# EAGLE design Wise-1510-v1.1.0 (EAGLE 7.7.0)

## Sheet 1 of 2
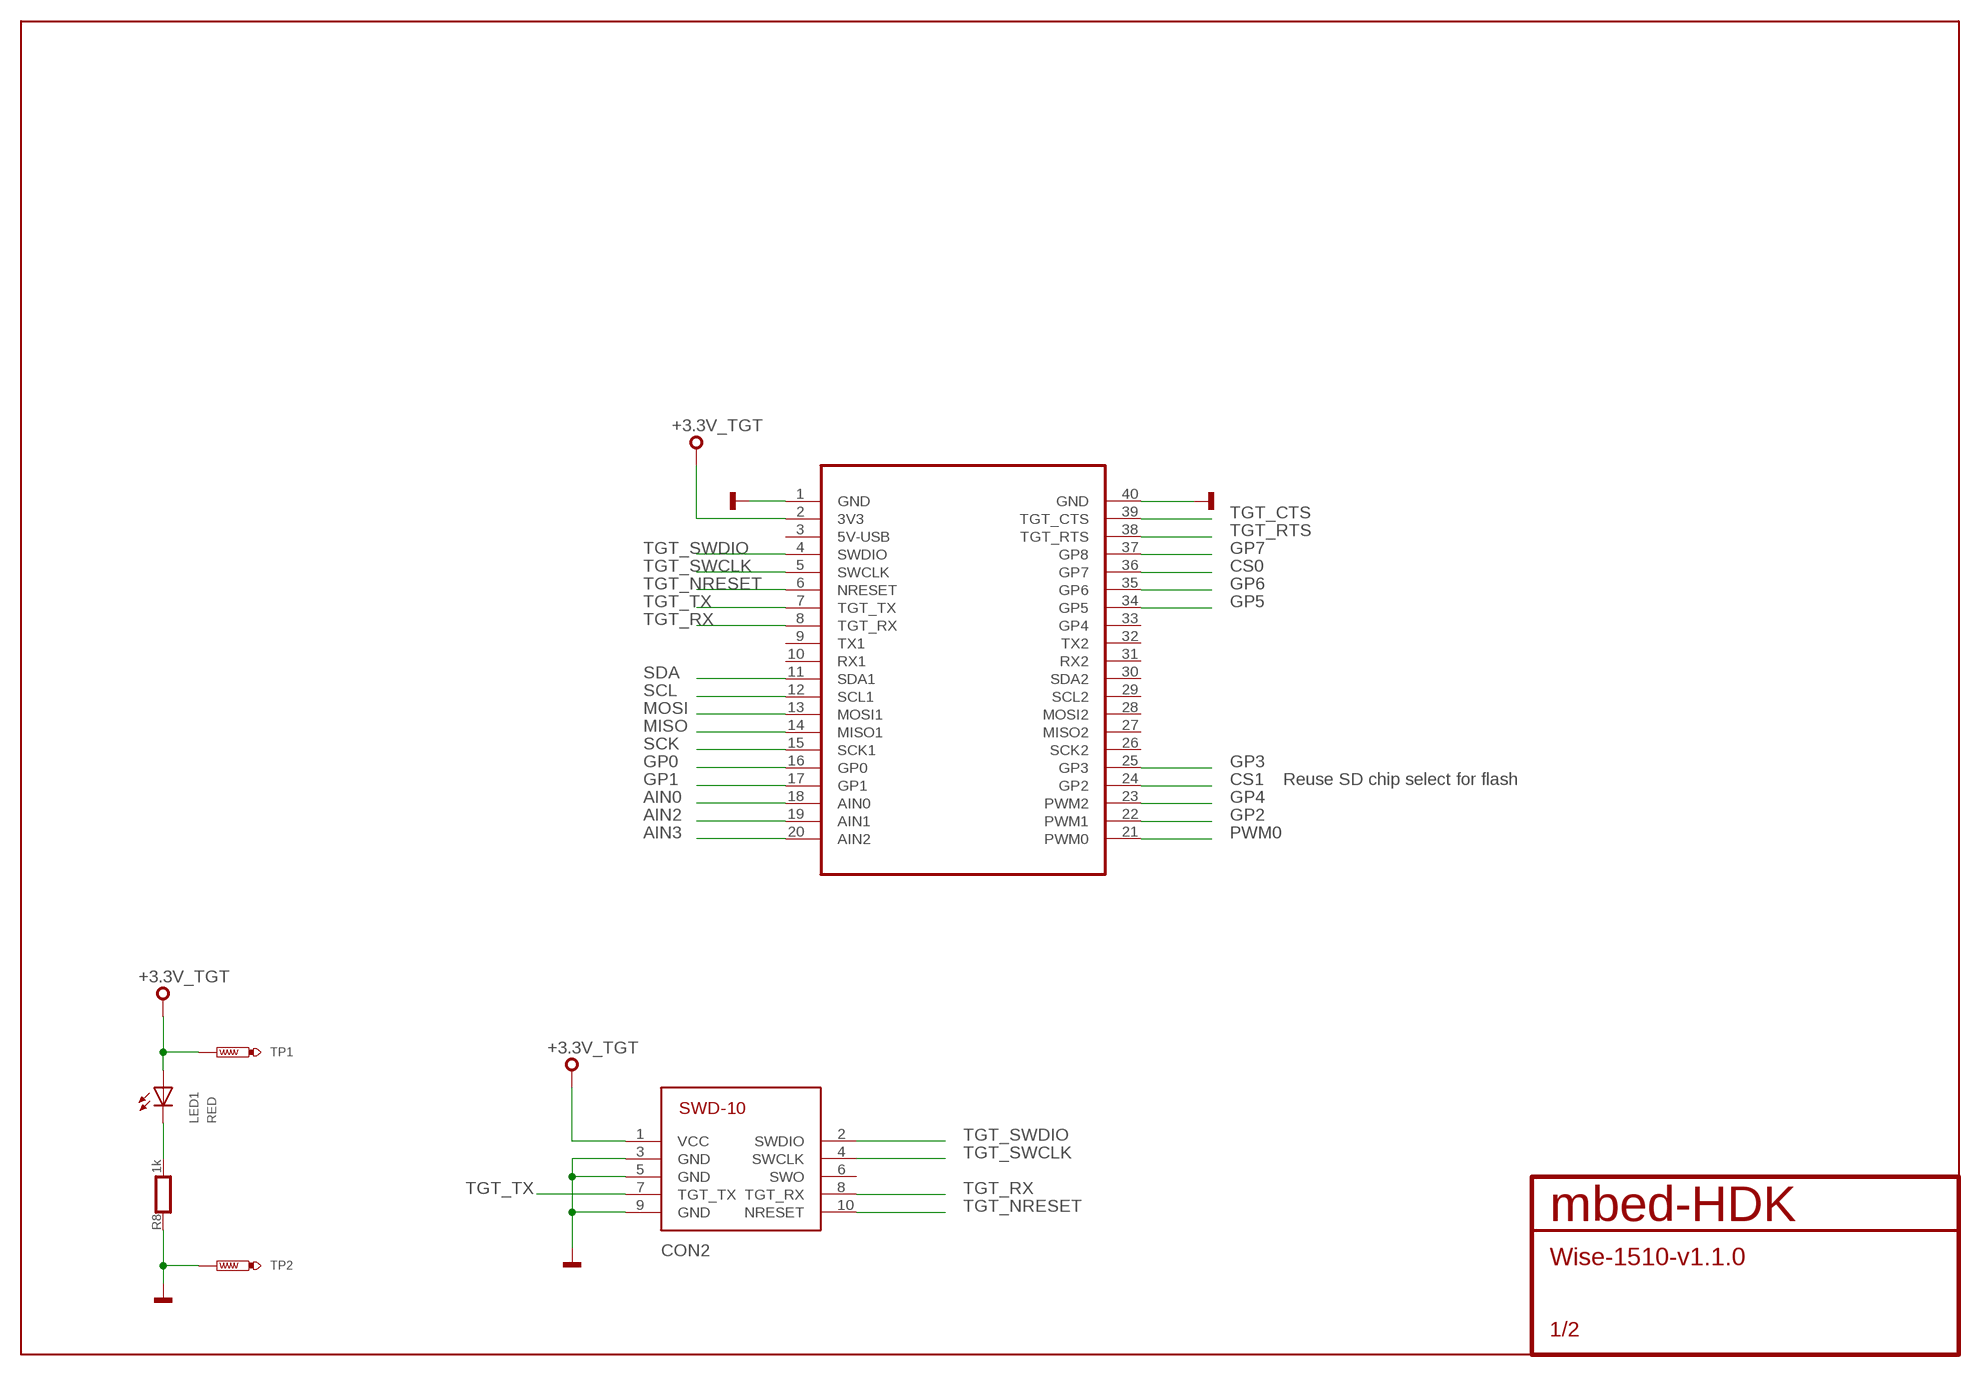
[diagram p0: schematic, sheet 1]

### Parts
CON2  SWD-10/TC2050_SMD  [FTSH-105-02]
LED1  RED  SMD_LED0603  [CHIPLED_0603]
R8  1k  RESISTOR0603  [0603]
TP1  TEST-POINT-50R-PTH  [TP50-PTH]
TP2  TEST-POINT-50R-PTH  [TP50-PTH]
U$1  MODULE_DAUGHTER  [MODULE_DAUGHTER]

### Nets
+3.3V_TGT: CON2.1(VCC) LED1.A TP1.TP U$1.2(3V3) ; also sheet 2
AIN0: U$1.18(AIN0) ; also sheet 2
AIN2: U$1.19(AIN1) ; also sheet 2
AIN3: U$1.20(AIN2) ; also sheet 2
CS0: U$1.36(GP7) ; also sheet 2
CS1: U$1.24(GP2) ; also sheet 2
GND: CON2.3(GND) CON2.5(GND) CON2.9(GND) R8.1 TP2.TP U$1.1(GND) U$1.40(GND) ; also sheet 2
GP0: U$1.16(GP0) ; also sheet 2
GP1: U$1.17(GP1) ; also sheet 2
GP2: U$1.22(PWM1) ; also sheet 2
GP3: U$1.25(GP3) ; also sheet 2
GP4: U$1.23(PWM2) ; also sheet 2
GP5: U$1.34(GP5) ; also sheet 2
GP6: U$1.35(GP6) ; also sheet 2
GP7: U$1.37(GP8) ; also sheet 2
MISO: U$1.14(MISO1) ; also sheet 2
MOSI: U$1.13(MOSI1) ; also sheet 2
PA_1: LED1.C R8.2
PWM0: U$1.21(PWM0) ; also sheet 2
SCK: U$1.15(SCK1) ; also sheet 2
SCL: U$1.12(SCL1) ; also sheet 2
SDA: U$1.11(SDA1) ; also sheet 2
TGT_CTS: U$1.39(TGT_CTS) ; also sheet 2
TGT_NRESET: CON2.10(NRESET) U$1.6(NRESET) ; also sheet 2
TGT_RTS: U$1.38(TGT_RTS) ; also sheet 2
TGT_RX: CON2.8(TGT_RX) U$1.8(TGT_RX) ; also sheet 2
TGT_SWCLK: CON2.4(SWCLK) U$1.5(SWCLK) ; also sheet 2
TGT_SWDIO: CON2.2(SWDIO) U$1.4(SWDIO) ; also sheet 2
TGT_TX: CON2.7(TGT_TX) U$1.7(TGT_TX) ; also sheet 2
Unconnected: CON2.6(SWO) U$1.3(5V-USB) U$1.9(TX1) U$1.10(RX1) U$1.26(SCK2) U$1.27(MISO2) U$1.28(MOSI2) U$1.29(SCL2) U$1.30(SDA2) U$1.31(RX2) U$1.32(TX2) U$1.33(GP4)

### Notes on the sheet
- Reuse SD chip select for flash

## Sheet 2 of 2
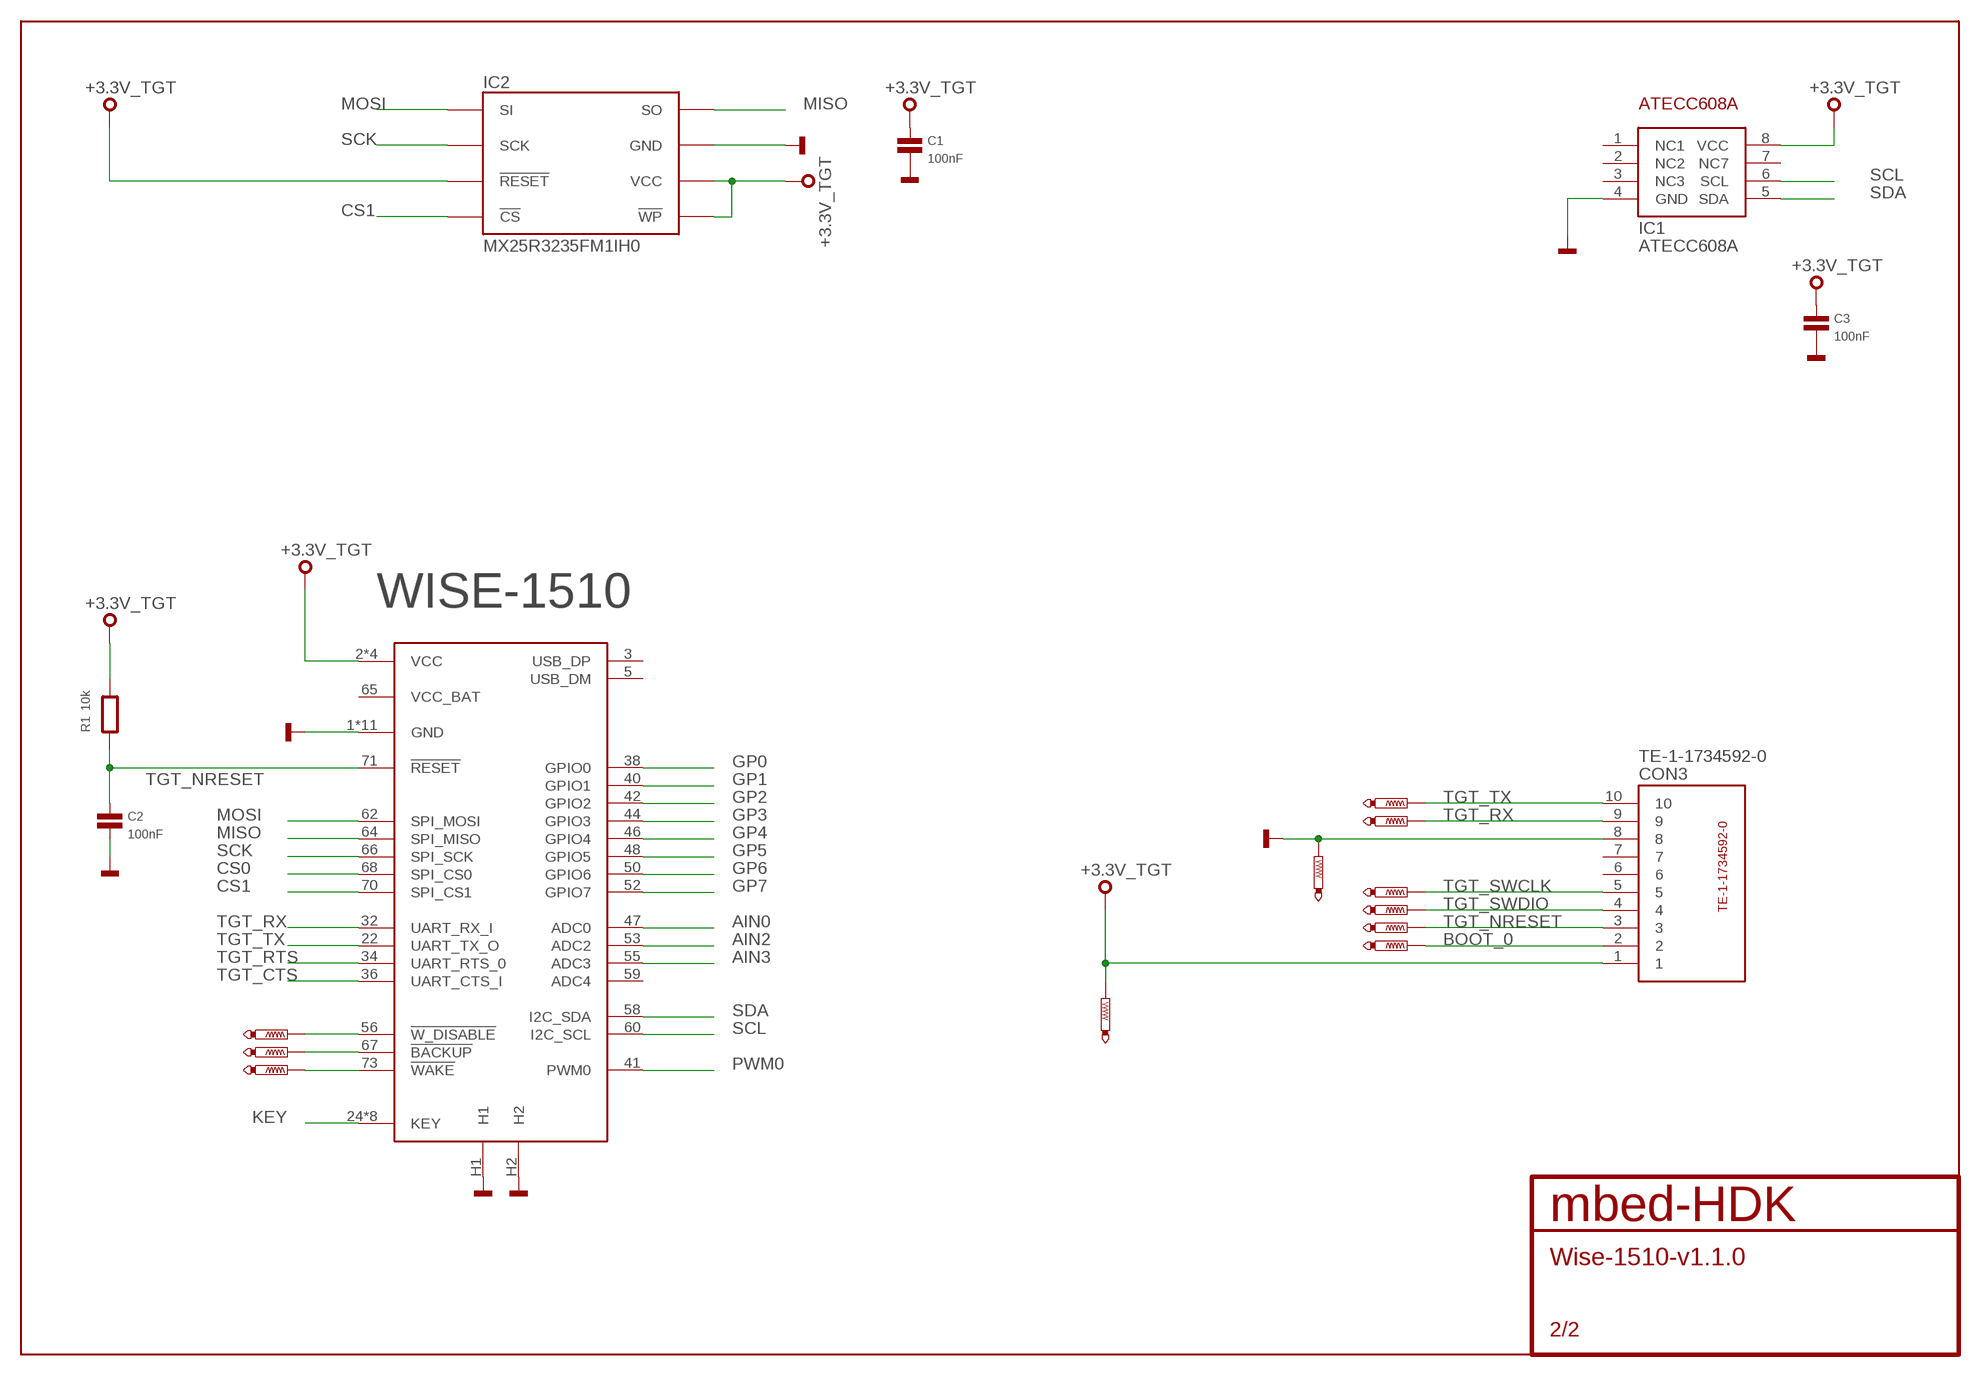
[diagram p1: schematic, sheet 2]

### Parts
C1  100nF  CAPACITOR0603  [0603]
C2  100nF  CAPACITOR0603  [0603]
C3  100nF  CAPACITOR0603  [0603]
CON1  WISE-1510_E  [MDT420E02001]
CON3  TE-1-1734592-0  [TE-1-1734592-0]
IC1  ATECC608A  [SO8]
IC2  MX25R3235FM1IH0  [SO8]
R1  10k  RESISTOR0603  [0603]
TP3  PTR1TP08R  [TP08R]
TP4  PTR1TP08R  [TP08R]
TP5  PTR1TP08R  [TP08R]
TP6  PTR1TP08R  [TP08R]
TP7  PTR1TP08R  [TP08R]
TP8  PTR1TP08R  [TP08R]
TP9  PTR1B1,27  [B1,27]
TP10  PTR1B1,27  [B1,27]
TP11  PTR1B1,27  [B1,27]
TP12  PTR1TP08R  [TP08R]
TP13  PTR1TP08R  [TP08R]

### Nets
+3.3V_TGT: C1.1 C3.1 CON1.2(VCC) CON1.4(VCC) CON1.72(VCC) CON1.74(VCC) CON3.1 IC1.8(VCC) IC2.3(!WP) IC2.7(!RESET) IC2.8(VCC) R1.2 TP12.TP ; also sheet 1
AIN0: CON1.47(ADC0) ; also sheet 1
AIN2: CON1.53(ADC2) ; also sheet 1
AIN3: CON1.55(ADC3) ; also sheet 1
BOOT_0: CON3.2 TP8.TP
CS0: CON1.68(SPI_CS0) ; also sheet 1
CS1: CON1.70(SPI_CS1) IC2.1(!CS) ; also sheet 1
GND: C1.2 C2.2 C3.2 CON1.1(GND) CON1.7(GND) CON1.18(GND) CON1.33(GND) CON1.39(GND) CON1.45(GND) CON1.51(GND) CON1.57(GND) CON1.63(GND) CON1.69(GND) CON1.75(GND) CON1.H1 CON1.H2 CON3.8 IC1.4(GND) IC2.4(GND) TP13.TP ; also sheet 1
GP0: CON1.38(GPIO0) ; also sheet 1
GP1: CON1.40(GPIO1) ; also sheet 1
GP2: CON1.42(GPIO2) ; also sheet 1
GP3: CON1.44(GPIO3) ; also sheet 1
GP4: CON1.46(GPIO4) ; also sheet 1
GP5: CON1.48(GPIO5) ; also sheet 1
GP6: CON1.50(GPIO6) ; also sheet 1
GP7: CON1.52(GPIO7) ; also sheet 1
KEY: CON1.24(KEY) CON1.25(KEY) CON1.26(KEY) CON1.27(KEY) CON1.28(KEY) CON1.29(KEY) CON1.30(KEY) CON1.31(KEY)
MISO: CON1.64(SPI_MISO) IC2.2(SO) ; also sheet 1
MOSI: CON1.62(SPI_MOSI) IC2.5(SI) ; also sheet 1
N$3: CON1.56(!W_DISABLE) TP9.TP
N$4: CON1.67(!BACKUP) TP10.TP
N$5: CON1.73(!WAKE) TP11.TP
PWM0: CON1.41(PWM0) ; also sheet 1
SCK: CON1.66(SPI_SCK) IC2.6(SCK) ; also sheet 1
SCL: CON1.60(I2C_SCL) IC1.6(SCL) ; also sheet 1
SDA: CON1.58(I2C_SDA) IC1.5(SDA) ; also sheet 1
TGT_CTS: CON1.36(UART_CTS_I) ; also sheet 1
TGT_NRESET: C2.1 CON1.71(!RESET) CON3.3 R1.1 TP5.TP ; also sheet 1
TGT_RTS: CON1.34(UART_RTS_0) ; also sheet 1
TGT_RX: CON1.32(UART_RX_I) CON3.9 TP6.TP ; also sheet 1
TGT_SWCLK: CON3.5 TP3.TP ; also sheet 1
TGT_SWDIO: CON3.4 TP4.TP ; also sheet 1
TGT_TX: CON1.22(UART_TX_O) CON3.10 TP7.TP ; also sheet 1
Unconnected: CON1.3(USB_DP) CON1.5(USB_DM) CON1.59(ADC4) CON1.65(VCC_BAT) CON3.6 CON3.7 IC1.1(NC1) IC1.2(NC2) IC1.3(NC3) IC1.7(NC7)

### Notes on the sheet
- WISE-1510

## Library data of the parts
C1-C3 = mbed-HDK-RLC:CAPACITOR: Capacitor
CON1 = blackbriar:WISE-1510
CON2 = mbed-HDK-Connector:SWD-10/TC2050: 1mm pitch 10-Pin Cortex Programming Header with optional TC2050 footprint solderless interchangeable
CON3 = blackbriar:TE-1-1734592-0
IC1 = blackbriar:ATECC608A
IC2 = blackbriar:MX25R3235FM1IH0: Serial Flash 32 Mb 80 Mhz; MF: Macronix; MFN: MX25R3235FM2IH0; OC-DIGIKEY: 1092-1174-ND
LED1 = mbed-HDK-Optical:SMD_LED: LED SMD, Colour Red; MF: Wurth Electronics Inc; MFN: 150060RS75000; OC-DIGIKEY: 732-4978-1-ND; OC-MOUSER: 710-150060RS75000; OC-NEWARK: 2322071
R1 R8 = mbed-HDK-RLC:RESISTOR: Resistor
TP1 TP2 = mbed-HDK:TEST-POINT
TP3-TP13 = blackbriar:PTR1: TEST PIN
U$1 = blackbriar:MODULE_DAUGHTER

## Board
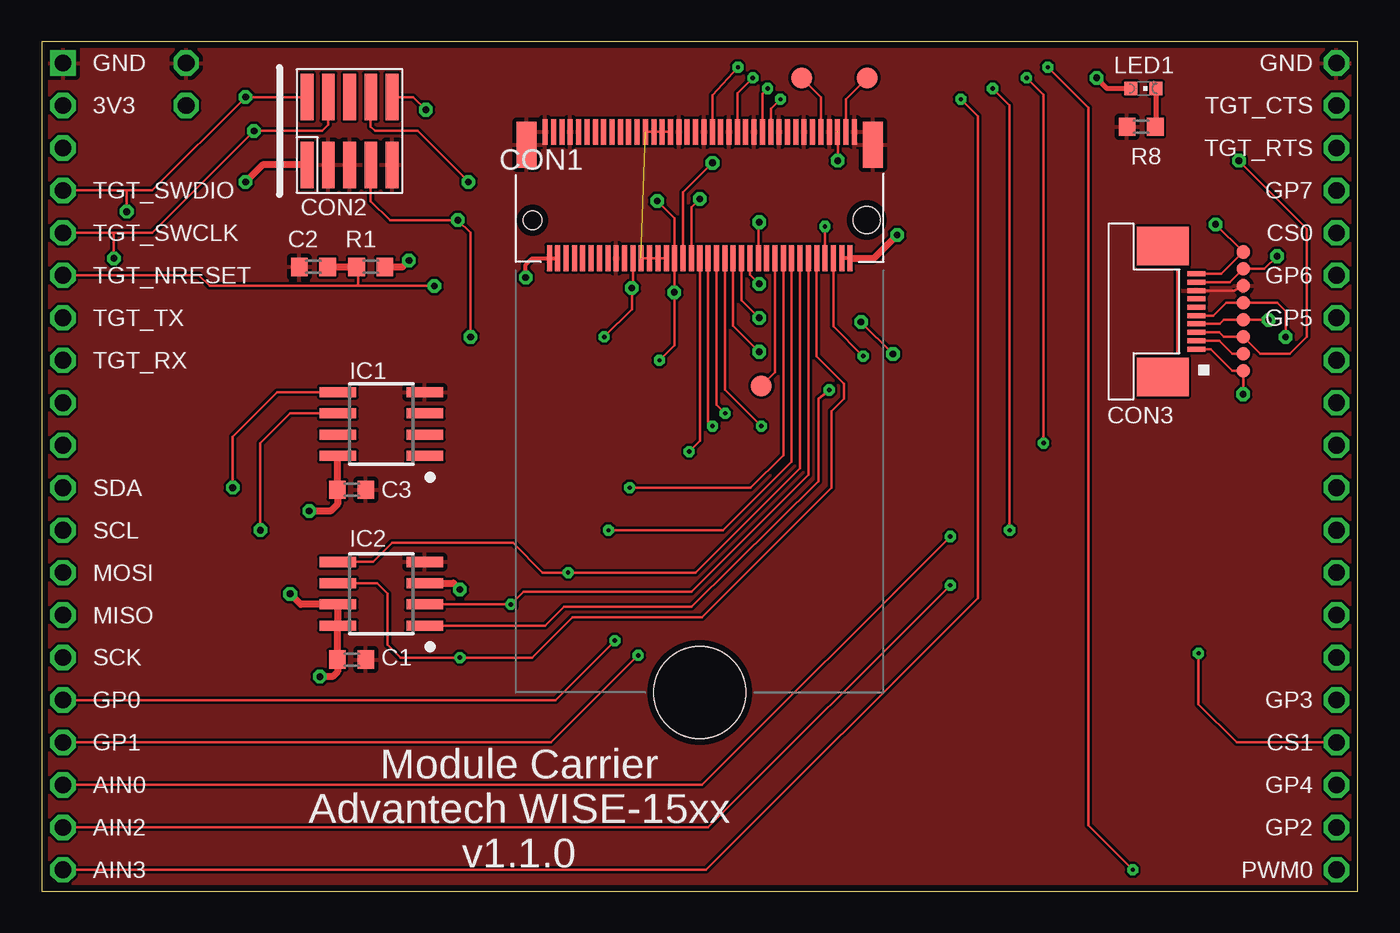
[diagram p2: board, top side]
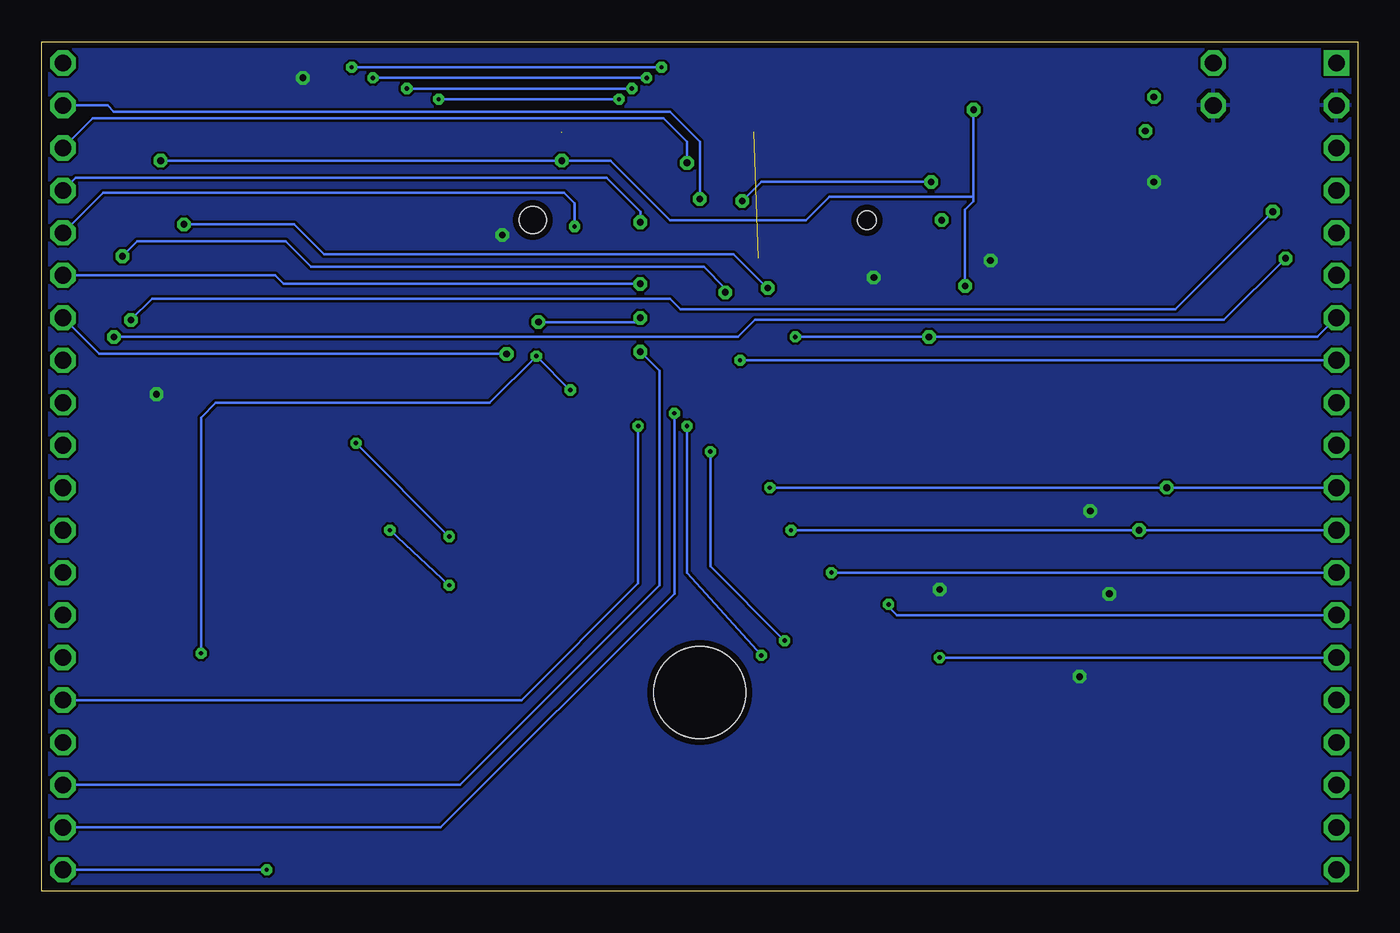
[diagram p3: board, bottom side, seen from below]

Size 78.74 x 50.8 mm. Coordinates in mm from the lower left corner, seen from the top.
Copper layers ((1*16)): Top 0.035mm / dielectric 0.8mm / Bottom 0.035mm
Design rules "mbed-HDK-6-6-2-layer": minimum track width 6mil, minimum drill 9mil, track to track 6mil, track to pad 6mil, pad to pad 6mil, via to via 6mil, smd to smd 6mil, copper to edge 15mil, drill to drill 8mil, minimum pad ring 10mil, minimum via ring 8mil, stop-mask expansion 4mil, vias tented up to drill 0mil, thermal gap 10mil

### Footprints (pad centres in the part's own frame; a part is rotated, then mirrored left to right if it is on the bottom)
0603 = smd 1 x 1.1: 1 -0.85,0; 2 0.85,0
MDT420E02001 = smd 0.3 x 1.55: 1 -9.25,5.275; 2 -9,-2.275; 3 -8.75,5.275; 4 -8.5,-2.275; 5 -8.25,5.275; 6 -8,-2.275; 7 -7.75,5.275; 8 -7.5,-2.275; 9 -7.25,5.275; 10 -7,-2.275; 11 -6.75,5.275; 12 -6.5,-2.275; 13 -6.25,5.275; 14 -6,-2.275; 15 -5.75,5.275; 16 -5.5,-2.275; 17 -5.25,5.275; 18 -5,-2.275; 19 -4.75,5.275; 20 -4.5,-2.275; 21 -4.25,5.275; 22 -4,-2.275; 23 -3.75,5.275; 24 -3.5,-2.275; 25 -3.25,5.275; 26 -3,-2.275; 27 -2.75,5.275; 28 -2.5,-2.275; 29 -2.25,5.275; 30 -2,-2.275; 31 -1.75,5.275; 32 -1.5,-2.275; 33 -1.25,5.275; 34 -1,-2.275; 35 -0.75,5.275; 36 -0.5,-2.275; 37 -0.25,5.275; 38 0,-2.275; 39 0.25,5.275; 40 0.5,-2.275; 41 0.75,5.275; 42 1,-2.275; 43 1.25,5.275; 44 1.5,-2.275; 45 1.75,5.275; 46 2,-2.275; 47 2.25,5.275; 48 2.5,-2.275; 49 2.75,5.275; 50 3,-2.275; 51 3.25,5.275; 52 3.5,-2.275; 53 3.75,5.275; 54 4,-2.275; 55 4.25,5.275; 56 4.5,-2.275; 57 4.75,5.275; 58 5,-2.275; 59 5.25,5.275; 60 5.5,-2.275; 61 5.75,5.275; 62 6,-2.275; 63 6.25,5.275; 64 6.5,-2.275; 65 6.75,5.275; 66 7,-2.275; 67 7.25,5.275; 68 7.5,-2.275; 69 7.75,5.275; 70 8,-2.275; 71 8.25,5.275; 72 8.5,-2.275; 73 8.75,5.275; 74 9,-2.275; 75 9.25,5.275 | smd 1.2 x 2.75: H1 -10.35,4.5; H2 10.35,4.5 | hole 1.1: -10,0 | hole 1.6: 10,0 | hole 5.5: 0,-28.25
FTSH-105-02 = smd 0.762 x 2.794: 1 0.381,-2.032; 2 0.381,2.032; 3 1.651,-2.032; 4 1.651,2.032; 5 2.921,-2.032; 6 2.921,2.032; 7 4.191,-2.032; 8 4.191,2.032; 9 5.461,-2.032; 10 5.461,2.032
TE-1-1734592-0 = smd 0.3 x 1.1: 1 2.25,0.5; 2 1.75,0.5; 3 1.25,0.5; 4 0.75,0.5; 5 0.25,0.5; 6 -0.25,0.5; 7 -0.75,0.5; 8 -1.25,0.5; 9 -1.75,0.5; 10 -2.25,0.5 | smd 2.3 x 3.1: P$1 -3.92,-1.5; P$2 3.92,-1.5
SO8 = smd 0.6 x 2.2: 1 -1.905,-2.6; 2 -0.635,-2.6; 3 0.635,-2.6; 4 1.905,-2.6; 5 1.905,2.6; 6 0.635,2.6; 7 -0.635,2.6; 8 -1.905,2.6
CHIPLED_0603 = smd 0.8 x 0.8: A 0,-0.75; C 0,0.75
TP50-PTH = drill 1 octagon: TP 0,0
TP08R = smd 0.8 x 0.8: TP 0,0
B1,27 = smd 1.27 x 1.27: TP 0,0
MODULE_DAUGHTER = drill 1 square: 1 0,0 | drill 1 octagon: 2 0,-2.54; 3 0,-5.08; 4 0,-7.62; 5 0,-10.16; 6 0,-12.7; 7 0,-15.24; 8 0,-17.78; 9 0,-20.32; 10 0,-22.86; 11 0,-25.4; 12 0,-27.94; 13 0,-30.48; 14 0,-33.02; 15 0,-35.56; 16 0,-38.1; 17 0,-40.64; 18 0,-43.18; 19 0,-45.72; 20 0,-48.26; 21 76.2,-48.26; 22 76.2,-45.72; 23 76.2,-43.18; 24 76.2,-40.64; 25 76.2,-38.1; 26 76.2,-35.56; 27 76.2,-33.02; 28 76.2,-30.48; 29 76.2,-27.94; 30 76.2,-25.4; 31 76.2,-22.86; 32 76.2,-20.32; 33 76.2,-17.78; 34 76.2,-15.24; 35 76.2,-12.7; 36 76.2,-10.16; 37 76.2,-7.62; 38 76.2,-5.08; 39 76.2,-2.54; 40 76.2,0

### Placement (x,y rotation side)
C1  18.54,13.84 0 top
C2  16.26,37.34 180 top
C3  18.54,24 0 top
CON1  39.37,40.13 0 top
CON2  15.49,45.47 0 top
CON3  68.58,34.67 270 top
IC1  20.32,27.94 90 top
IC2  20.32,17.78 90 top
LED1  65.91,48.01 270 top
R1  19.68,37.34 0 top
R8  65.79,45.72 0 top
TP1  8.64,46.99 0 top
TP2  8.64,49.53 0 top
TP3  71.88,35.18 0 top
TP4  71.88,34.16 0 top
TP5  71.88,33.15 0 top
TP6  71.88,37.21 0 top
TP7  71.88,38.23 0 top
TP8  71.88,32.13 0 top
TP9  43.05,30.23 90 top
TP10  45.47,48.64 90 top
TP11  49.4,48.64 90 top
TP12  71.88,31.11 0 top
TP13  71.88,36.2 0 top
U$1  1.27,49.53 0 top

### Tracks (layer width: path | path; a pad name or v marks a point on that pad's centre or on a via)
+3.3V_TGT  (via drill 0.41)
  Top 0.152: CON3.1 69.94,32.42 71.25,31.11 TP12.TP v71.88,29.72
  Top 0.254: v28.96,36.7 28.96,37.47 29.34,37.85 30.36,37.85 | 30.36,37.85 CON1.2 | 30.86,37.85 CON1.4 30.86,37.85 30.36,37.85 | CON1.74 CON1.72
  Top 0.305: LED1.A 63.75,48.01 v63.12,48.64
  Top 0.406: v16.64,12.83 17.4,12.83 17.69,13.12 C1.1 17.69,15.85 IC2.8 IC2.7 15.49,17.14 v14.86,17.78 | IC2.3 24.64,18.41 v25.02,18.03 | v16,22.73 17.27,22.73 17.69,23.15 C3.1 17.69,26.01 IC1.8 | CON2.1 13.21,43.43 v12.19,42.42 | CON1.74 49.8,37.86 v51.18,39.24 | R1.2 21.59,37.34 v21.97,37.72
  pour Bottom: 0,0 78.74,0 78.74,50.8 0,50.8
AIN0  (via drill 0.25)
  Top 0.152: U$1.18 39.5,6.35 v54.36,21.21 | v42.55,48.64 41.62,47.72 CON1.47 | v59.94,26.8 59.94,47.62 v58.93,48.64
  Bottom 0.152: v42.55,48.64 v58.93,48.64 | v54.36,21.21 v59.94,26.8
AIN2  (via drill 0.25)
  Top 0.152: U$1.19 39.88,3.81 v54.36,18.29 | v43.43,48.01 43.12,47.69 CON1.53 | v57.91,21.59 57.91,46.99 v56.9,48.01
  Bottom 0.152: v43.43,48.01 v56.9,48.01 | v54.36,18.29 v57.91,21.59
AIN3  (via drill 0.25)
  Top 0.152: U$1.20 39.75,1.27 56.01,17.53 56.01,46.35 v54.99,47.37 | v44.2,47.37 43.62,46.8 CON1.55
  Bottom 0.152: v44.2,47.37 v54.99,47.37
BOOT_0
  Top 0.152: 69.08,32.89 CON3.2 70.46,32.92 71.25,32.13 TP8.TP
CS0  (via drill 0.25)
  Top 0.152: v46.86,39.75 CON1.68
  Bottom 0.152: v46.86,39.75 46.86,41.15 47.5,41.78 75.06,41.78 U$1.36
CS1  (via drill 0.25)
  Top 0.152: v69.22,14.22 69.22,11.18 71.5,8.89 U$1.24 | v47.12,29.97 46.48,29.46 46.48,24.51 38.86,17.02 31.24,17.02 30.1,15.88 IC2.1 | CON1.70 47.37,33.78 v49.15,32
  Bottom 0.152: v69.22,14.22 69.22,28.32 68.33,29.21 51.94,29.21 v49.15,32 v47.12,29.97
GND
  Top 0.152: 45.62,44.98 45.59,44.96 | CON3.8 71.35,35.92 71.37,35.94 TP13.TP
  pour Top: 0,0 78.74,0 78.74,50.8 0,50.8
GP0  (via drill 0.25)
  Top 0.152: v38.73,26.29 39.37,26.92 CON1.38 | v34.29,14.99 30.73,11.43 U$1.16
  Bottom 0.152: v38.73,26.29 38.73,19.43 v34.29,14.99
GP1  (via drill 0.25)
  Top 0.152: U$1.17 30.48,8.89 v35.69,14.1 | v40.13,27.81 39.87,28.07 CON1.40
  Bottom 0.152: v40.13,27.81 40.13,19.05 v35.69,14.1
GP2  (via drill 0.25)
  Top 0.152: v40.89,28.57 40.39,29.08 40.39,37.84 CON1.42
  Bottom 0.152: v40.89,28.57 40.89,17.78 54.86,3.81 U$1.22
GP3  (via drill 0.25)
  Top 0.152: CON1.44 40.87,30 v43.05,27.81
  Bottom 0.152: v43.05,27.81 43.05,18.41 50.04,11.43 50.8,11.43 51.18,11.43 U$1.25
GP4  (via drill 0.41)
  Top 0.152: CON1.46 41.37,33.81 v42.93,32.26
  Bottom 0.152: v42.93,32.26 41.78,31.11 41.78,18.29 53.72,6.35 U$1.23
GP5  (via drill 0.41)
  Top 0.152: CON1.48 41.87,35.35 v42.93,34.29 | v49.02,34.04 v50.93,32.13
  Bottom 0.152: U$1.34 75.31,32.13 52.07,32.13 51.69,32.13 v50.93,32.13 | v42.93,34.29 43.18,34.04 v49.02,34.04
GP6  (via drill 0.41)
  Top 0.152: CON1.50 42.37,36.88 v42.93,36.32
  Bottom 0.152: v42.93,36.32 64.26,36.32 64.77,36.83 U$1.35
GP7  (via drill 0.41)
  Top 0.152: CON1.52 42.87,39.95 v42.93,40.01
  Bottom 0.152: U$1.37 76.71,42.67 44.96,42.67 42.93,40.64 v42.93,40.01
KEY  (1 unrouted)
  Top 0.152: CON1.24 CON1.26 CON1.28 CON1.30 | CON1.25 CON1.27 CON1.29 CON1.31
MISO  (via drill 0.25)
  Top 0.152: IC2.2 v28.07,17.14 28.83,17.91 38.86,17.91 45.87,24.91 CON1.64
  Bottom 0.152: v28.07,17.14 28.07,17.02 27.56,16.51 U$1.14
MOSI  (via drill 0.25)
  Top 0.152: IC2.5 19.81,19.68 20.95,20.83 28.19,20.83 29.97,19.05 v31.5,19.05 39.12,19.05 45.37,25.3 CON1.62
  Bottom 0.152: v31.5,19.05 U$1.13
N$3
  Top 0.152: CON1.56 43.87,31.04 TP9.TP
N$4
  Top 0.152: TP10.TP 46.62,47.49 CON1.67
N$5
  Top 0.152: TP11.TP 48.12,47.36 CON1.73
N$6
  Top 0.152: 67.94,37.08 67.94,32.26
PA_1
  Top 0.305: LED1.C 66.66,45.75 R8.2
PWM0  (via drill 0.25)
  Top 0.152: v41.66,49.28 40.12,47.61 CON1.41 | v60.2,49.28 62.61,46.86 62.61,3.94 v65.28,1.27
  Bottom 0.152: v41.66,49.28 v60.2,49.28 | v65.28,1.27 U$1.21
SCK  (via drill 0.25)
  Top 0.152: IC2.6 20.07,18.41 20.7,17.78 20.7,14.73 21.46,13.97 v25.02,13.97 29.34,13.97 31.75,16.38 39.5,16.38 47.24,24.13 47.24,28.7 48.01,29.46 48.01,30.35 46.35,32 46.35,37.84 CON1.66
  Bottom 0.152: v25.02,13.97 U$1.15
SCL  (via drill 0.25, 0.41)
  Top 0.152: v33.91,21.59 40.77,21.59 44.87,25.69 CON1.60 | IC1.6 14.86,28.57 13.08,26.8 v13.08,21.59
  Bottom 0.152: v33.91,21.59 v13.08,21.59 U$1.12
SDA  (via drill 0.25, 0.41)
  Top 0.152: v35.18,24.13 42.42,24.13 44.37,26.08 CON1.58 | IC1.5 14.1,29.84 11.43,27.18 v11.43,24.13
  Bottom 0.152: v35.18,24.13 v11.43,24.13 U$1.11
TGT_CTS  (via drill 0.41)
  Top 0.152: CON1.36 38.87,40.9 v39.37,41.4
  Bottom 0.152: U$1.39 74.8,46.99 74.42,46.61 41.15,46.61 39.37,44.83 v39.37,41.4
TGT_NRESET  (via drill 0.41)  (1 unrouted)
  Top 0.152: U$1.6 9.4,36.83 10.03,36.2 18.92,36.2 | v22.99,46.74 22.23,47.5 CON2.10 | 18.92,36.2 v23.5,36.2 | v47.62,43.69 CON1.71 | 69.08,33.4 CON3.3 70.47,33.42 70.74,33.15 TP5.TP 72.9,32.13 74.68,32.13 75.69,33.15 75.69,39.62 v71.63,43.69 | R1.1 18.92,37.34 18.92,36.2
  Top 0.406: C2.1 R1.1
  Bottom 0.152: 22.99,41.53 22.99,41.27 23.5,40.77 v23.5,36.2 | 22.99,41.53 v22.99,46.74 | v71.63,43.69 v47.62,43.69 44.7,43.69 41.15,40.13 33.02,40.13 31.62,41.53 22.99,41.53
TGT_RTS  (via drill 0.41)
  Top 0.152: CON1.34 38.37,41.8 v40.13,43.56
  Bottom 0.152: U$1.38 75.69,46.23 41.53,46.23 40.13,44.83 v40.13,43.56
TGT_RX  (via drill 0.25, 0.41)
  Top 0.152: CON2.8 19.68,45.72 19.94,45.47 22.48,45.47 v25.53,42.42 | v36.96,31.75 37.87,32.66 | v36.83,41.27 37.87,40.23 CON1.32 37.87,35.84 v37.85,35.81 37.87,35.79 37.87,32.66 | CON3.9 71.09,36.42 TP6.TP 73.15,37.21 v73.91,37.97 | 37.87,32.66 37.85,32.69
  Bottom 0.152: v36.96,31.75 U$1.8 | v25.53,42.42 35.69,42.42 v36.83,41.27 | v73.91,37.97 73.03,38.86 64.14,38.86 62.61,37.34 39.12,37.34 37.85,36.07 v37.85,35.81
TGT_SWCLK  (via drill 0.41)
  Top 0.152: U$1.5 4.32,39.37 | 4.32,39.37 6.6,39.37 v12.7,45.47 16.76,45.47 17.14,45.85 CON2.4 | v4.32,37.85 4.32,39.37 | CON3.5 70.11,34.42 70.87,35.18 TP3.TP 73.91,35.18 74.42,34.67 v74.42,33.15
  Bottom 0.152: v74.42,33.15 37.08,33.15 36.07,34.16 8,34.16 v4.32,37.85
TGT_SWDIO  (via drill 0.41)
  Top 0.152: U$1.4 5.08,41.91 | 5.08,41.91 6.6,41.91 v12.19,47.5 CON2.2 | v5.08,40.64 5.08,41.91 | 69.08,33.91 CON3.4 70.5,33.92 70.74,34.16 TP4.TP v73.41,34.16
  Bottom 0.152: v5.08,40.64 10.92,34.8 40.51,34.8 41.15,35.43 72.14,35.43 v73.41,34.16
TGT_TX  (via drill 0.25, 0.41)
  Top 0.152: CON2.7 19.68,41.27 20.83,40.13 v24.89,40.13 25.65,39.37 v25.65,33.15 | v33.66,33.15 35.31,34.8 v35.31,36.07 35.37,36.13 CON1.22 | CON3.10 70.58,36.92 TP7.TP v70.23,39.88
  Bottom 0.152: U$1.7 2.41,33.15 v25.65,33.15 v33.66,33.15 | v35.31,36.07 37.34,38.1 61.85,38.1 63.63,39.88 v70.23,39.88

### Text on the board
tPlace: GND / 3V3 / / TGT_SWDIO / TGT_SWCLK / TGT_NRESET / TGT_TX / TGT_RX / / / SDA / SCL / MOSI / MISO / SCK / GP0 / GP1 / AIN0 / AIN2 / AIN3 | GND / TGT_CTS / TGT_RTS / GP7 / CS0 / GP6 / GP5 / / / / / / / / / GP3 / CS1 / GP4 / GP2 / PWM0 | Module Carrier / Advantech WISE-15xx / v1.1.0